# Altium schematic sheet top.SchDoc
size A4
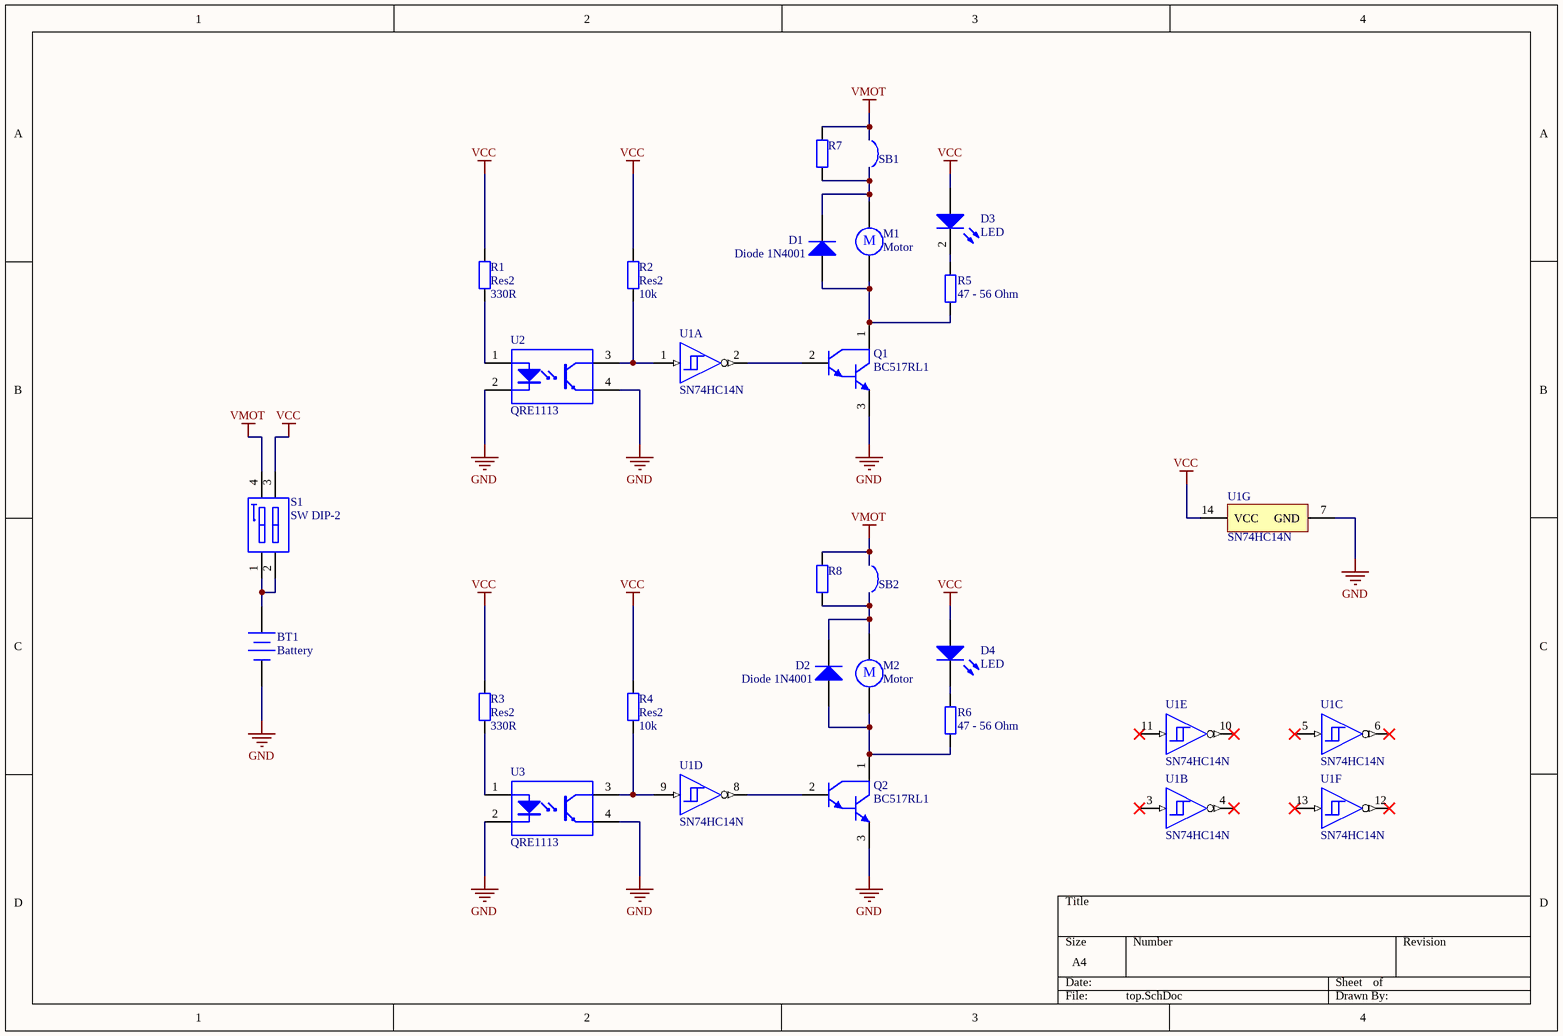
[diagram p0: top.SchDoc]

## Parts
BT1  Battery  [BC2AAPC]
D1  Diode 1N4001  [DO-41]
D2  Diode 1N4001  [DO-41]
D3  LED  [LED]
D4  LED  [LED]
M1  Motor  [Motor Wire Footprint]
M2  Motor  [Motor Wire Footprint]
Q1  BC517RL1  [ONSC-TO-92-3-29-11_AM_BL]
Q2  BC517RL1  [ONSC-TO-92-3-29-11_AM_BL]
R1  Res2  value 330R  [AXIAL-0.4]
R2  Res2  value 10k  [AXIAL-0.4]
R3  Res2  value 330R  [AXIAL-0.4]
R4  Res2  value 10k  [AXIAL-0.4]
R5  value 47 - 56 Ohm  [AXIAL-0.4]  (hidden comment: Res2)
R6  value 47 - 56 Ohm  [AXIAL-0.4]  (hidden comment: Res2)
R7  Res2  [AXIAL-0.4]  (value not drawn)
R8  Res2  [AXIAL-0.4]  (value not drawn)
S1  SW DIP-2  [DIP-4]
SB1  Solder Bridge  [Solder Bridge]  (value not drawn)
SB2  Solder Bridge  [Solder Bridge]  (value not drawn)
U1  SN74HC14N  [N0014A]  (parts A,B,C,D,E,F,G of 7)
U2  QRE1113  [QRE1113_THD]
U3  QRE1113  [QRE1113_THD]

## Nets
GND: BT1.2(-) Q1.3(E) Q2.3(E) U1.7(GND) U2.2(CATHODE) U2.4(EMITTER) U3.2(CATHODE) U3.4(EMITTER)
VCC: D3.1(A) D4.1(A) R1.2 R2.2 R3.2 R4.2 S1.3(B2) U1.14(VCC)
VMOT: R7.2 R8.2 S1.4(B1) SB1.1 SB2.1
NetBT1_1: BT1.1(+) S1.1(A1) S1.2(A2)
NetD1_1: D1.1(A) M1.2 Q1.1(C) R5.1
NetD1_2: D1.2(K) M1.1 R7.1 SB1.2
NetD2_1: D2.1(A) M2.2 Q2.1(C) R6.1
NetD2_2: D2.2(K) M2.1 R8.1 SB2.2
NetD3_2: D3.2(K) R5.2
NetD4_2: D4.2(K) R6.2
NetQ1_2: Q1.2(B) U1.2(~{1Y})
NetQ2_2: Q2.2(B) U1.8(~{4Y})
NetR1_1: R1.1 U2.1(ANODE)
NetR2_1: R2.1 U1.1(1A) U2.3(COLLECTOR)
NetR3_1: R3.1 U3.1(ANODE)
NetR4_1: R4.1 U1.9(4A) U3.3(COLLECTOR)

Not connected (* = marked no-connect by the designer): U1 3(2A)* 4(~{2Y})* 5(3A)* 6(~{3Y})* 10(~{5Y})* 11(5A)* 12(~{6Y})* 13(6A)*

## Notes on the sheet
- (in symbol Motor) M

## Library data of the parts
BT1 = Battery: Multicell Battery; Published: 24-Mar-1999; LatestRevisionDate: 17-Jul-2002; LatestRevisionNote: Re-released for DXP Platform.; PackageReference: BAT-2; Publisher: Altium Limited; PackageDescription: Battery; 2 Leads; Supplier 1: Digi-Key; Supplier Part Number 1: BC2AAPC-ND
D1 D2 = Diode 1N4001: 1 Amp General Purpose Rectifier; Published: 8-Jun-2000; LatestRevisionDate: 17-Jul-2002; LatestRevisionNote: Re-released for DXP Platform.; DatasheetVersion: 1998; PackageVersion: Aug-1999; PackageReference: DO-41; Publisher: Altium Limited; PackageDescription: Diode, Axial; Body 5.2 x 2.7 mm (LxDia. max), Lead Dia. 0.86 mm (max); Code_JEDEC: DO-204-AL; ComponentLink1Description: Manufacturer Link; ComponentLink1URL: http://www.fairchildsemi.com/; ComponentLink2Description: Datasheet; ComponentLink2URL: http://www.fairchildsemi.com/ds/1N%2F1N4001.pdf
D3 D4 = LED0: Typical INFRARED GaAs LED; Published: 8-Jun-2000; LatestRevisionDate: 08-Jul-2005; LatestRevisionNote: Mech Layer 1 removed.; PackageReference: LED-0; Publisher: Altium Limited; PackageDescription: LED; 2 Leads; Supplier 1: Farnell; Supplier Part Number 1: 1142587
M1 M2 = Motor: Motor, General Kind; Published: 24-Mar-1999; LatestRevisionDate: 17-Jul-2002; LatestRevisionNote: Re-released for DXP Platform.; PackageReference: RB5-10.5; Publisher: Altium Limited; PackageDescription: Capacitor (Radial); 2 Leads; Supplier 1: Farnell; Supplier Part Number 1: 599104
Q1 Q2 = CMP-1031-00058-1: Darlington Transistor, NPN Silicon, 3-Pin TO-92, Tape and Reel; Manufacturer: On Semiconductor; IC Continuous (A): 1; PackageReference: TO-92-3-29-11_AM_BL; PackageDescription: 3-Pin Transistor Outline, Body 4.825 x 3.685 mm, Pitch 1.27 mm; ComponentLink3URL: http://www.onsemi.com/pub_link/Collateral/MAC97-D.PDF; RoHS: FALSE; ComponentLink2Description: Datasheet; ComponentLink1Description: Manufacturer URL; PartNumber: BC517RL1; Polarity: NPN; ComponentLink3Description: Package Specification; DatasheetVersion: Rev. 5; Packing: Tape and Reel; ComponentLink2URL: http://www.onsemi.cn/pub_link/Collateral/BC517-D.PDF; Mounting Technology: Through Hole; ComponentLink1URL: http://www.onsemi.com/; PackageVersion: Rev. AM
R1-R6 = Res2: Resistor; Published: 8-Jun-2000; LatestRevisionDate: 17-Jul-2002; LatestRevisionNote: Re-released for DXP Platform.; PackageReference: AXIAL-0.4; Publisher: Altium Limited; PackageDescription: Axial Device, Thru-Hole; 2 Leads; 0.4 in Pin Spacing
R7 R8 = Res2: Resistor; Value: 1K; Published: 8-Jun-2000; LatestRevisionDate: 17-Jul-2002; LatestRevisionNote: Re-released for DXP Platform.; PackageReference: AXIAL-0.4; Publisher: Altium Limited; PackageDescription: Axial Device, Thru-Hole; 2 Leads; 0.4 in Pin Spacing
S1 = SW DIP-2: DIP Switch, 2 Position, SPST; Published: 24-Mar-1999; LatestRevisionDate: 17-Jul-2002; LatestRevisionNote: Re-released for DXP Platform.; PackageReference: DIP-4; Publisher: Altium Limited
U1 = CMP-1615-00889-3: Hex Schmitt-Trigger Inverters, N0014A, TUBE; Manufacturer: Texas Instruments; Input Type: CMOS; Voltage(Nom)(V): 5; VCC(Min)(V): 2; tpd @ Nom Voltage(Max)(ns): 31; Technology Family: HC; VCC(Max)(V): 6; F @ Nom Voltage(Max)(Mhz): 20; Output Drive (IOL/IOH)(Max)(mA): -4/4; Rating: Catalog; Schmitt Trigger: Yes; ICC @ Nom Voltage(Max)(mA): 0.02; PackageReference: N0014A; Code_JEDEC: MS-001; Operating Temperature Range(C): -40 to 85; Generic Part Number: SN74HC14; Bits(#): 6; DatasheetVersion: SCLS085G; Output Type: CMOS
U2 U3 = CMP-2000-06919-1: Miniature Reflective Object Sensor, 30 V, -40 to 85 degC, 4-Pin THD, RoHS, Tape and Reel; Manufacturer: FairchildSemiconductor; Maximum Collector Emitter Voltage: 30V; Lead Finish: MatteTin; Maximum Rise Time: 20000(Typ)ns; Rad Hard: No; Number of Channels per Chip: 1; Maximum Collector Current: 20mA; Wavelength: 940nm; Maximum Forward Current: 50mA; Maximum Reverse Voltage: 5V; Packaging: Tape&Reel; Package Reference: QRE1113GR; Package Description: 4-Pin Surface Mount Device, Body 3.4 x 2.7 mm, Pitch 1.8 mm; Mounting Technology: SurfaceMount; Manufacturer URL: https://www.fairchildsemi.com/; Package: 4MiniatureSMT; Minimum Operating Temperature: -40°C; Type: Reflective; Maximum Operating Temperature: 85°C; Category: Photointerrupter; Datasheet URL: https://www.fairchildsemi.com/datasheets/QR/QRE1113.pdf; Maximum Fall Time: 20000(Typ)ns; Datasheet Version: Rev. 2.7 , 04/2016